# Altium schematic sheet Ballast and Depth Controller.SchDoc: Active Ballast Controller
size A; DrawnBy: Adam Vadala-Roth; DocumentNumber: 1; Revision: 2.1a; SheetNumber: 1; SheetTotal: 5
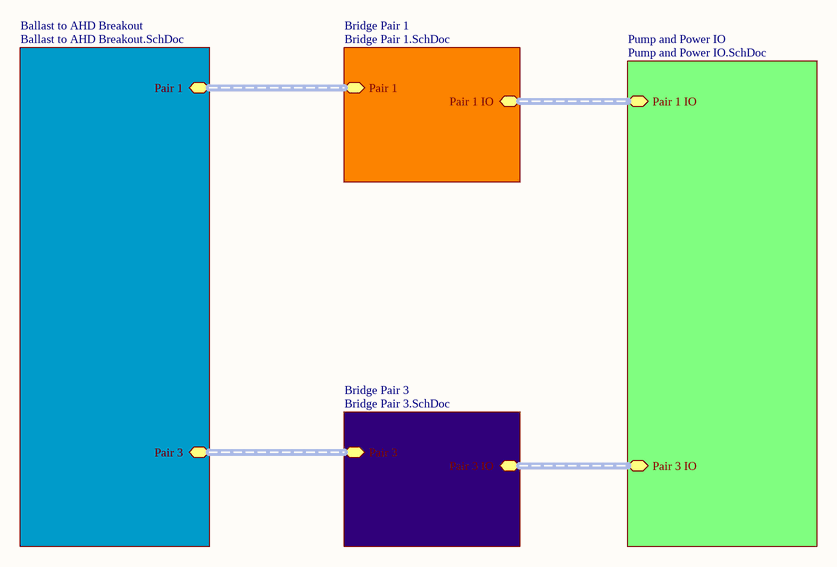
[diagram p0: Ballast and Depth Controller.SchDoc]

## Sub-sheets
Ballast to AHD Breakout = Ballast to AHD Breakout.SchDoc: Pair 1 (harness Pair_1_AHD), Pair 3 (harness Pair_3_AHD)
Bridge Pair 1 = Bridge Pair 1.SchDoc: Pair 1 (harness Pair_1_AHD), Pair 1 IO (harness Pair_1_IO)
Bridge Pair 3 = Bridge Pair 3.SchDoc: Pair 3 (harness Pair_3_AHD), Pair 3 IO (harness Pair_3_IO)
Pump and Power IO = Pump and Power IO.SchDoc: Pair 1 IO (harness Pair_1_IO), Pair 3 IO (harness Pair_3_IO)

## Buses and harness runs
harness sheet Ballast to AHD Breakout/Pair 1 = sheet Bridge Pair 1/Pair 1
harness sheet Ballast to AHD Breakout/Pair 3 = sheet Bridge Pair 3/Pair 3
harness sheet Bridge Pair 1/Pair 1 IO = sheet Pump and Power IO/Pair 1 IO
harness sheet Bridge Pair 3/Pair 3 IO = sheet Pump and Power IO/Pair 3 IO